# Altium project Motorsteuerung.PrjPcb
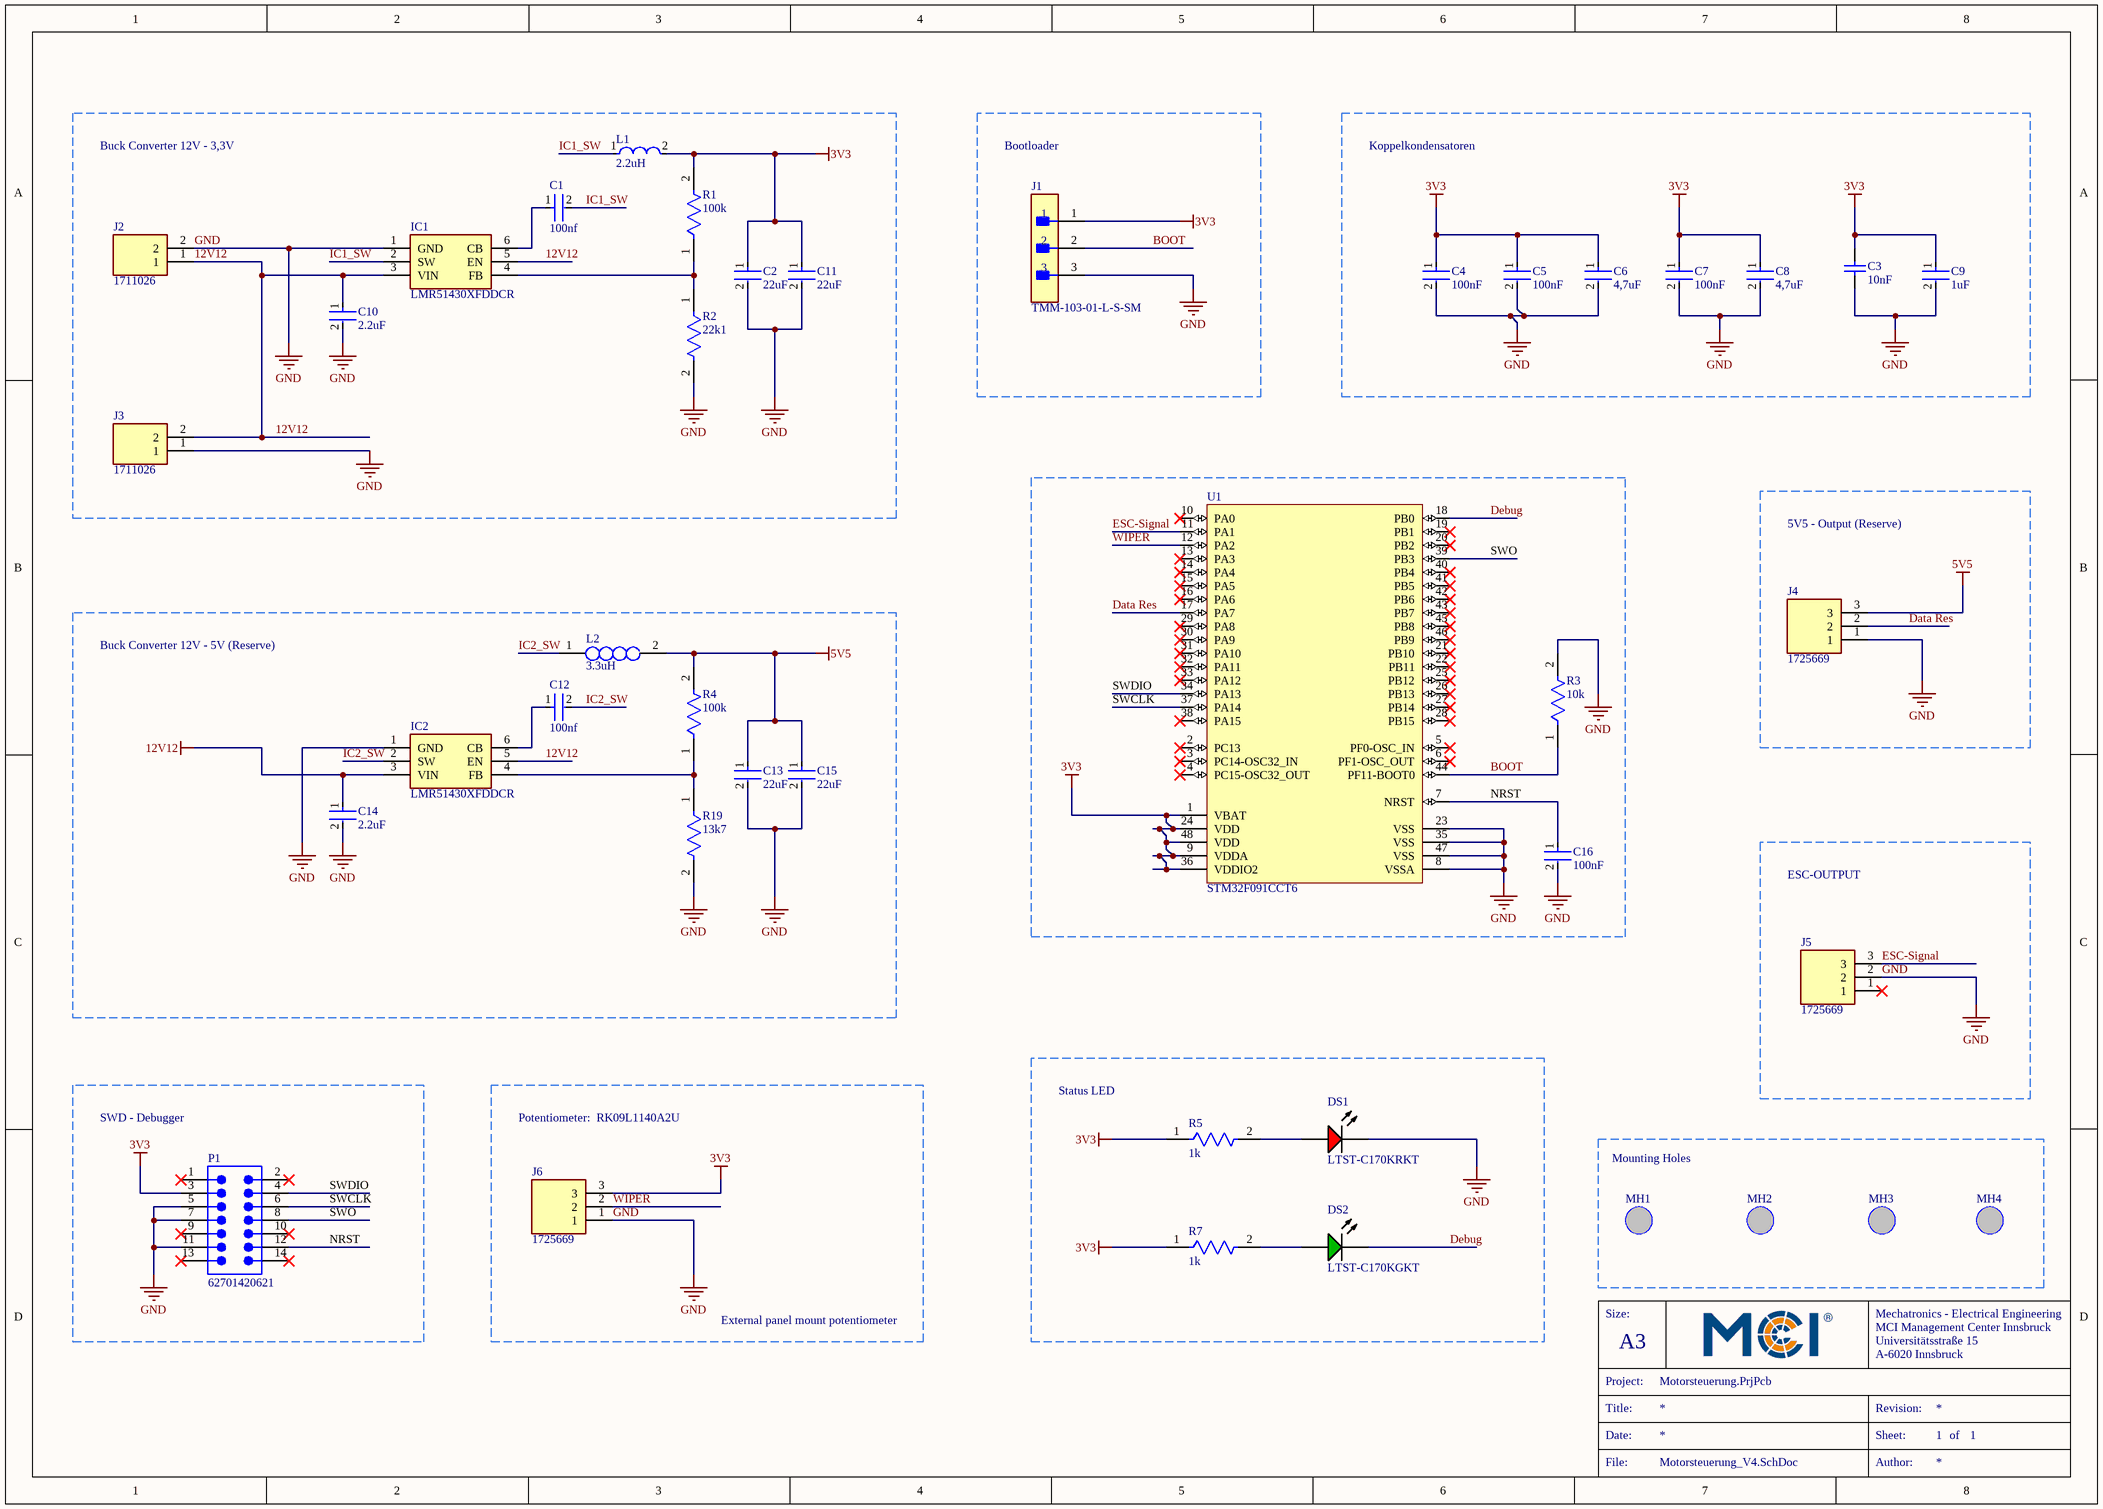
[diagram p0: Motorsteuerung_V4.SchDoc]
1 sheet, 41 parts. Net scope: global (net labels, ports and power ports of the same name join across sheets).
Board file: PCB1.PcbDoc

## Sheet Motorsteuerung_V4.SchDoc
size A3; CompanyName: MCI Management Center Innsbruck; Address1: Universitätsstraße 15; Address2: A-6020 Innsbruck; SheetNumber: 1; SheetTotal: 1

### Parts
C1  100nf  [FP-C0805C104M5UACTU-MFG]
C2  22uF  [FP-C1210C226K4RACTU-MFG]
C3  10nF  [CAPC1608X92X38ML15T08]
C4  100nF  [FP-CC0603-DA-MFG]
C5  100nF  [FP-CC0603-DA-MFG]
C6  4,7uF  [FP-CC0603-DA-MFG]
C7  100nF  [FP-CC0603-DA-MFG]
C8  4,7uF  [FP-CC0603-DA-MFG]
C9  1uF  [FP-CC0603-DA-MFG]
C10  2.2uF  [FP-CC1210-G3-MFG]
C11  22uF  [FP-C1210C226K4RACTU-MFG]
C12  100nf  [FP-C0805C104M5UACTU-MFG]
C13  22uF  [FP-C1210C226K4RACTU-MFG]
C14  2.2uF  [FP-CC1210-G3-MFG]
C15  22uF  [FP-C1210C226K4RACTU-MFG]
C16  100nF  [FP-CC0805-EB-MFG]
DS1  LTST-C170KRKT  [LTST-C170KRKT_V]
DS2  LTST-C170KGKT  [LTST-LTST-C170KGKT-2_V]
IC1  LMR51430XFDDCR  [SOT95P280X110-6N]
IC2  LMR51430XFDDCR  [SOT95P280X110-6N]
J1  TMM-103-01-L-S-SM  [FP-TMM-103-01-L-S-SM-MFG]
J2  1711026  [1711026]
J3  1711026  [1711026]
J4  1725669  [1725669]
J5  1725669  [1725669]
J6  1725669  [1725669]
L1  2.2uH  [FP-IHLP-2020BZ-FP_1_905x2-MFG]
L2  3.3uH  [INDPM6054X300N]
MH1  (no value)  [MTH]
MH2  (no value)  [MTH]
MH3  (no value)  [MTH]
MH4  (no value)  [MTH]
P1  62701420621  [62701420621]
R1  100k  [FP-RQ73C2A-IPC_B]
R2  22k1  [FP-RT0805-MFG]
R3  10k  [FP-AT0805-MFG]
R4  100k  [FP-RQ73C2A-IPC_B]
R5  1k  [FP-AT0805-IPC_C]
R7  1k  [FP-AT0805-IPC_C]
R19  13k7  [FP-RT0805-MFG]
U1  STM32F091CCT6  [LQFP48_M]

### Blocks framed on the sheet
Buck Converter 12V - 3,3V: C1 C2 C10 C11 IC1 J2 J3 L1 R1 R2
Bootloader: J1
Koppelkondensatoren: C3-C9
5V5 - Output (Reserve): J4
Buck Converter 12V - 5V (Reserve): C12-C15 IC2 L2 R4 R19
ESC-OUTPUT: J5
SWD - Debugger: P1
Status LED: DS1 DS2 R5 R7
Mounting Holes: MH1-MH4

### Nets
3V3: C2.1 C3.2 C4.1 C5.1 C6.1 C7.1 C8.1 C9.1 C11.1 J1.1 J6.3 L1.2 P1.3 R1.2 R5.1 R7.1 U1.1(VBAT) U1.9(VDDA) U1.24(VDD) U1.36(VDDIO2) U1.48(VDD)
5V5: C13.1 C15.1 J4.3 L2.2 R4.2
12V12: C10.1 C14.1 IC1.3(VIN) IC1.5(EN) IC2.3(VIN) IC2.5(EN) J2.1 J3.2
GND: C2.2 C3.1 C4.2 C5.2 C6.2 C7.2 C8.2 C9.2 C10.2 C11.2 C13.2 C14.2 C15.2 C16.2 DS1.2(K) IC1.1(GND) IC2.1(GND) J1.3 J2.2 J3.1 J4.1 J5.2 J6.1 P1.5 P1.7 P1.11 R2.2 R3.2 R19.2 U1.8(VSSA) U1.23(VSS) U1.35(VSS) U1.47(VSS)
BOOT: J1.2 R3.1 U1.44(PF11-BOOT0)
Data Res: J4.2 U1.17(PA7)
Debug: DS2.1(K) U1.18(PB0)
ESC-Signal: J5.3 U1.11(PA1)
IC1_SW: C1.2 IC1.2(SW) L1.1
IC2_SW: C12.2 IC2.2(SW) L2.1
NRST: C16.1 P1.12 U1.7(NRST)
SWCLK: P1.6 U1.37(PA14)
SWDIO: P1.4 U1.34(PA13)
SWO: P1.8 U1.39(PB3)
WIPER: J6.2 U1.12(PA2)
NetC1_1: C1.1 IC1.6(CB)
NetC12_1: C12.1 IC2.6(CB)
NetDS1_1: DS1.1(A) R5.2
NetDS2_2: DS2.2(A) R7.2
NetIC1_4: IC1.4(FB) R1.1 R2.1
NetIC2_4: IC2.4(FB) R4.1 R19.1

Not connected (* = marked no-connect by the designer): J5 1*; P1 1* 2* 9* 10* 13* 14*; U1 2(PC13)* 3(PC14-OSC32_IN)* 4(PC15-OSC32_OUT)* 5(PF0-OSC_IN)* 6(PF1-OSC_OUT)* 10(PA0)* 13(PA3)* 14(PA4)* 15(PA5)* 16(PA6)* 19(PB1)* 20(PB2)* 21(PB10)* 22(PB11)* 25(PB12)* 26(PB13)* 27(PB14)* 28(PB15)* 29(PA8)* 30(PA9)* 31(PA10)* 32(PA11)* 33(PA12)* 38(PA15)* 40(PB4)* 41(PB5)* 42(PB6)* 43(PB7)* 45(PB8)* 46(PB9)*

### Notes on the sheet
- Potentiometer:  RK09L1140A2U
- External panel mount potentiometer
- Size:
- Mechatronics - Electrical Engineering
- Project:
- A3
- Title:
- Date:
- Revision:
- Sheet:
- of
- File:
- Author:

### Library data of the parts
C1 C12 = CMP-2007-03742-2: CAP CER 0.1UF 50V Z5U 0805; Dielectric Material: Ceramic; Tolerance: 20%; Dissipation Factor: 4%; Height: 0.78mm; Dielectric: Z5U; REACH SVHC: No SVHC; Min Operating Temperature: 10°C; Lead Pitch: 0.75mm; Construction: Flat; Mount: Surface Mount; Max Operating Temperature: 85°C; RoHS Compliant: Yes; Width: 1.2mm; Contact Plating: Tin; Thickness: 0.035inch; Series: C; Capacitance: 100nF; Packaging: Tape and Reel; Package Quantity: 1; Voltage Rating (DC): 50V; Termination: SMD/SMT; Voltage: 50V; Case Code (Metric): 2012; Depth: 1.25mm; Radiation Hardening: No; Case/Package: 0805; Length: 2mm; Case Code (Imperial): 0805; Voltage Rating: 50V; Number of Pins: 2; Lead Free: Lead Free
C2 C11 C13 C15 = CMP-03020-034651-1: CAP CER 22UF 16V X7R 1210; Dielectric Material: Ceramic; Tolerance: 10%; Dissipation Factor: 5%; Case Code (Imperial): 1210; Capacitance: 22uF; Height: 2.5mm; Termination: SMD/SMT; Package Quantity: 1000; Voltage Rating (DC): 16V; Voltage: 16V; Depth: 2.5mm; Case Code (Metric): 3225; Mount: Surface Mount; Packaging: Cut Tape; Dielectric: X7R; Length: 3.2mm; REACH SVHC: No SVHC; Case/Package: 1210; Min Operating Temperature: -55°C; Voltage Rating: 16V; Max Operating Temperature: 125°C; Weight: 0.000564oz; Width: 0.098inch; Thickness: 0.11inch
C3 = CMP-2006-01137-1: Manufacturer: Vitramon; Part Number: VJ0603Y103KXJAC
C4 C5 C7 = CMP-03422-000234-1: CAP CER 0.1UF 25V X7R 0603; Manufacturer: YAGEO; Manufacturer Part Number: CC0603KRX7R8BB104; Tolerance: 0.1; Temperature Coefficient: 15%; Material: Ceramic; Category: Cap; Capacitance: 100 nF; ComponentLink2URL: http://www.yageo.com/documents/recent/UPY-GPHC_X7R_6.3V-to-50V_18.pdf; Voltage Rating: 25 V; ComponentLink2Description: Datasheet; RoHS: TRUE; Octopart: https://octopart.com/cc0603krx7r8bb104-yageo-8376534; Mouser Description: CC Series 0603 0.1 uF 25 V ±10% Tolerance X7R SMT Multilayer Ceramic Capacitor; Device Class L2: Capacitors; Automotive: No; Temperature Range Low: -55°C; Lead Free: Yes; Temperature Range High: +125°C; Package: CC0603-DA; Temperature: -55°C to +125°C; Footprint Url: http://www.yageo.com/exep/pages/download/literatures/UPY-C_GEN_24.pdf; Height: 0.9mm; Voltage: 25 V; Temperature Characteristic: X7R; Value: 100 nF; Device Class L3: Ceramic Capacitors; Digikey Description: CAP CER 0.1UF 25V X7R 0603; Device Class L1: Passive Components
C6 C8 = CMP-03422-001236-1: CAP CER 4.7UF 16V X5R 0603; Manufacturer: YAGEO; Manufacturer Part Number: CC0603KRX5R7BB475; Temperature Coefficient: 15%; Material: Ceramic; Tolerance: 0.1; Temperature Characteristic: X5R; Footprint Url: http://www.yageo.com/exep/pages/download/literatures/UPY-C_GEN_24.pdf; ComponentLink2URL: http://www.yageo.com/documents/recent/UPY-GPHC_X7R_6.3V-to-50V_18.pdf; ComponentLink2Description: Datasheet; Device Class L3: Ceramic Capacitors; Category: Cap; Voltage Rating: 16 V; Automotive: No; Temperature Range High: +125°C; Value: 4.7 uF; Device Class L1: Passive Components; RoHS: TRUE; Device Class L2: Capacitors; Voltage: 16 V; Height: 0.9mm; Temperature Range Low: -55°C; Temperature: -55°C to +125°C; Capacitance: 4.7 uF; Mouser Description: Multilayer Ceramic Capacitors MLCC - SMD/SMT 4.7uF 16V X5R 10%; Octopart: https://octopart.com/cc0603krx5r7bb475-yageo-34978295; Package: CC0603-DA; Lead Free: Yes; Digikey Description: CAP CER 4.7UF 16V X5R 0603
C9 = CMP-1035-02737-2: CAP CER 1UF 16V X5R 0603; Manufacturer Part Number: CC0603KRX5R7BB105; Manufacturer: YAGEO; Material: Ceramic; Temperature Coefficient: 15%; Tolerance: 0.1; Digikey Description: CAP CER 1UF 16V X5R 0603; Category: Cap; Automotive: No; Octopart: https://octopart.com/cc0603krx5r7bb105-yageo-8376530; Voltage Rating: 16 V; Device Class L3: Ceramic Capacitors; Value: 1 uF; Temperature Characteristic: X5R; Voltage: 16 V; RoHS: TRUE; Lead Free: Yes; Temperature: -55°C to +125°C; Device Class L2: Capacitors; ComponentLink2URL: http://www.yageo.com/documents/recent/UPY-GPHC_X7R_6.3V-to-50V_18.pdf; Capacitance: 1 uF; Footprint Url: http://www.yageo.com/exep/pages/download/literatures/UPY-C_GEN_24.pdf; Height: 0.9mm; ComponentLink2Description: Datasheet; Temperature Range High: +125°C; Mouser Description: Multilayer Ceramic Capacitors MLCC - SMD/SMT 1.0uF 16V X5R 10%; Package: CC0603-DA; Device Class L1: Passive Components; Temperature Range Low: -55°C
C10 C14 = CMP-03422-001503-1: CAP CER 1210; Dielectric: X7R; Tolerance: 10%; Depth: 2.5mm; Max Operating Temperature: 125°C; Capacitance: 2.2uF; RoHS Compliant: Yes; Length: 3.2mm; Min Operating Temperature: -55°C; Case/Package: 1210; Packaging: Tape and Reel
C16 = CMP-00621-107850848-1: CC0805KKX7RYBB104 Capacitor Ceramic 0.01uF 250V X7R 10% 0805 T/R; Material: Ceramic; Max Operating Temperature: 125°C; Tolerance: 10%; Case/Package: 0805; NexarPartId: 107850848; Height: 1.45mm; Capacitance: 100nF; Min Operating Temperature: -55°C; Voltage Rating: 250V
DS1 = CMP-2000-07593-1: LED Red, 75 mW, 54 mcd, -55 to 85 degC, 2-Pin SMD, RoHS, Tape and Reel; Manufacturer: Lite-On; Lens Transparency: Clear; Number of Elements: 1; Power Rating: 75mW; Luminous Intensity: 54mcd; Viewing Angle: 130degrees; Forward Current: 30mA; Wavelength: 639nm; Lens Style: Rectangular; Case\/Package: 0805; Test Current: 20mA; Dominant Wavelength: 631nm; Forward Voltage: 2V; Lens Colour: Colorless; Min Operating Temperature: -55degC; RoHSCompliant: True; Length: 3.2mm; Width: 1.25mm; Mount: SurfaceMount; Packaging: TapeandReel; Number of LEDs: 1; Radiation Hardening: No; Datasheet URL: http://optoelectronics.liteon.com/upload/download/DS-22-99-0150/LTST-C170KRKT.pdf; Datasheet Version: Rev. D, 11/2014; Case Code (Metric): 2012; Height: 1.1mm; Number of Pins: 2; Package Description: 2-Pin Surface Mount Device, Body 2 x 1.25 mm; Manufacturer URL: http://www.us.liteon.com/; Lead Free: LeadFree; Illumination Colour: Red; Colour: Red; Case Code (Imperial): 0805; Max Operating Temperature: 85degC; Power Dissipation: 75mW; Mounting Technology: SurfaceMount; Package Reference: C170KRKT; Package Quantity: 1; Depth: 1.6mm
DS2 = CMP-2000-06620-1: Ultra Bright AlInGaP Chip LED, 75 mW, -55 to 85 degC, 2-Pin SMD (0805), RoHS, Tape and Reel; Manufacturer: Lite-On; Forward Current: 30mA; Power Dissipation Max: 75mW; Emitting Color: YellowGreen; Type: Uni-Color; Forward Voltage: 2.4V; Dominant Wave Length: 571nm; Test Current (It): 20mA; Product Length (mm): 2mm; Peak Wavelength: 574nm; Power Dissipation: 75W; Product Depth (mm): 1.25mm; DELETED: Compliant; High Brightness: Yes; Product Height (mm): 1.1mm; Luminous Intensity: 35mcd; Shape Type: Rectangular; Chip Material: AlGaInP; Viewing Angle: 130deg; Number of  Elements: 1; Reverse Voltage: 5V; Rad Hardened: No; Package Type: ChipLed; Manufacturer URL: http://www.us.liteon.com/; Mounting: SurfaceMount; Operating Temp Range: -55Cto85C; Datasheet URL: http://optoelectronics.liteon.com/upload/download/DS22-2000-073/S_110_LTST-C170KGKT.pdf; Packaging: TapeandReel; Pin Count: 2; Package Description: 2-Pin Surface Mounted Device, Body 2 x 1.25 mm; Mounting Technology: SurfaceMount; Package Reference: LTST-C170KGKT-2; Forward Current Max: 30mA; Datasheet Version: Rev. G, 06/2005; Lens Dimensions: 1.4x1.25x0.6mm; Operating Temperature Classification: Industrial; Lum Intensity: 35mcd; Main Category: ChipLED
IC1 IC2 = LMR51430XFDDCR: Integrated Circuit; Manufacturer_Name: Texas Instruments; Datasheet Link: https://www.ti.com/lit/ds/symlink/lmr51420.pdf?ts=1651317966125; Height: 1.1mm; Manufacturer_Part_Number: LMR51430XFDDCR; Mouser Part Number: 595-LMR51430XFDDCR; Mouser Price/Stock: https://www.mouser.co.uk/ProductDetail/Texas-Instruments/LMR51430XFDDCR?qs=vvQtp7zwQdOoH7ISqkGKmw%3D%3D; Arrow Part Number: LMR51430XFDDCR; Arrow Price/Stock: https://www.arrow.com/en/products/lmr51430xfddcr/texas-instruments.html?utm_currency=USD&region=nac
J1 = CMP-02766-001735-1: CONN HEADER SMD 3POS 2MM; Number of Positions: 3; Max Current Rating: 3.9A; Gender: Male; Max Voltage Rating (AC): 500V; Packaging: Bulk; Housing Color: Black; Connector Type: Header; Min Operating Temperature: -55°C; Contact Plating: Gold; Radiation Hardening: No; Insulation Color: Black; Housing Material: Polymer; Contact Shape: Square; Max Operating Temperature: 125°C; Fastening Type: Pull; Termination: Solder; Depth: 1.97mm; Series: TMM; Number of Contacts: 3; Contact Material: Bronze; RoHS Compliant: Yes; REACH SVHC: No SVHC; Contact Type: Male Pin; Pitch: 2mm; Insulation Material: Polymer; Lead Free: Lead Free; Orientation: Straight; Flammability Rating: UL94 V-0; Length: 6mm; Number of Rows: 1; Contact Finish - Mating: GOLD
J2 J3 = 1711026: Connector; Manufacturer_Name: Phoenix Contact; Datasheet Link: https://www.phoenixcontact.com/en-us/products/printed-circuit-board-terminal-mkds-3-2-1711026?type=pdf; Height: 18.2mm; Manufacturer_Part_Number: 1711026; Mouser Part Number: 651-1711026; Mouser Price/Stock: https://www.mouser.co.uk/ProductDetail/Phoenix-Contact/1711026?qs=JcjeNNoqGSMahJ%2FDM5awSg%3D%3D; Arrow Part Number: 1711026; Arrow Price/Stock: https://www.arrow.com/en/products/1711026/phoenix-contact?utm_currency=USD&region=nac
J4-J6 = 1725669: Connector; Manufacturer_Name: Phoenix Contact; Datasheet Link: https://www.phoenixcontact.com/en-us/products/printed-circuit-board-terminal-mpt-05-3-254-1725669?type=pdf; Height: 8.65mm; Manufacturer_Part_Number: 1725669; Mouser Part Number: 651-1725669; Mouser Price/Stock: https://www.mouser.co.uk/ProductDetail/Phoenix-Contact/1725669?qs=A%2FKWGUWTCZjmkTL0Oe91ew%3D%3D; Arrow Part Number: 1725669; Arrow Price/Stock: https://www.arrow.com/en/products/1725669/phoenix-contact?utm_currency=USD&region=nac
L1 = CMP-02424-000260-1: Fixed Inductors Commercial Low DCR Series 2.2uH 5A 37.7mΩ 20%; Test Frequency: 100kHz; Self Resonant Frequency: 41MHz; Shielding: Shielded; Saturation Current: 5.5A; DC Resistance (DCR): 37.7mR; Core Material: Metal; RMS Current (Irms): 5A; Case/Package: 2020; Width: 0.204inch; Inductance: 2.2uH; Height - Seated (Max): 0.079inch; Package Quantity: 2000; Length: 5.74mm; Inductance Tolerance: 20%; Tolerance: 20%; Height: 2mm; Min Operating Temperature: -55°C; Termination: SMD/SMT; Current Rating: 5A; Mount: Surface Mount; Max DC Current: 5.5A; Packaging: Tape and Reel; Number of Pins: 2; Max Operating Temperature: 125°C; Depth: 5.43mm; Military Standard: Not; Radiation Hardening: No; Contact Plating: Tin; Lead Free: Lead Free
L2 = PA4340.332NLT: Inductor; Manufacturer_Name: Yageo Group; Datasheet Link: https://www.arrow.com/en/products/pa4340.332nlt/pulse-electronics-corporation; Height: 3mm; Manufacturer_Part_Number: PA4340.332NLT; Mouser Part Number: 673-PA4340.332NLT; Mouser Price/Stock: https://www.mouser.co.uk/ProductDetail/Pulse-Electronics/PA4340332NLT?qs=%2FzQKu7YvIMZ40DmrCvsoMQ%3D%3D; Arrow Part Number: PA4340.332NLT; Arrow Price/Stock: https://www.arrow.com/en/products/pa4340.332nlt/pulse-electronics-corporation?utm_currency=USD&region=europe
MH1-MH4 = MountingHole
P1 = CMP-03913-133967346-2: Conn, Hdr, 14Pos, 2Row, 1.27Mm, Smt Rohs Compliant: Yes; Current Rating: 1A; Insulation Resistance: 1GΩ; Max Operating Temperature: 105°C; Min Operating Temperature: -40°C; Number of Pins: 14; RoHS: Compliant; Pitch: 1.27mm; Length: 13.64mm
R1 R4 = CMP-03211-011351-1: RQ73 0805 100KΩ 0.2W 10ppm/°C 0.1% 100V
R2 = CMP-2001-01692-2: RES SMD 22.1K OHM 0.1% 1/8W 0805; Manufacturer Part Number: RT0805BRD0722K1L; Manufacturer: Yageo; Temperature Coefficient: 25 ppm/°C; Voltage Rating: 150V; Tolerance: 0.0025; Resistance: 22.1KΩ; Value: 22.1KΩ; Power Rating: 0.125W; Lead Free: Yes; Series: RT; Digikey Description: RES SMD 22.1K OHM 0.1% 1/8W 0805; Mouser Description: Thin Film Resistors - SMD 1/8W 22.1K ohm .1% 25ppm; Device Class L3: Chip SMD Resistors; ComponentLink2URL: http://www.yageo.com/documents/recent/PYu-RT_1-to-0.01_RoHS_L_9.pdf; Octopart: https://octopart.com/rt0805brd0722k1l-yageo-1447960; ComponentLink2Description: Datasheet; Temperature Range High: +155°C; Height: 0.6mm; Composition: Thin Film; Temperature Range Low: -55°C; RoHS: TRUE; Device Class L2: Resistors; Automotive: No; Ipc Land Pattern Name: RESC200125X50; Device Class L1: Passive Components; Temperature: -55°C to +155°C; Category: Res; Package: RT0805; Footprint Url: http://www.yageo.com/exep/pages/download/literatures/PYu-R_Mount_10.pdf
R3 = CMP-03412-049031-1: Thin Film Chip Resistors Automotive Grade 10kΩ 0.5% 50ppm/°C 0805; Max Power Dissipation: 125mW; Resistance: 10kR; Ratings: AEC-Q200; Length: 0.079inch; Temperature Coefficient: 50ppm/°C; Height: 0.024inch; Min Operating Temperature: -55°C; Case/Package: 0805; Tolerance: 0.5%; RoHS Compliant: Yes; Features: Moisture Resistant; Number of Terminations: 2; Max Operating Temperature: 155°C; Series: AT; Packaging: Tape and Reel; Width: 0.049inch; Resistor Type: Thin Film
R5 R7 = CMP-03412-050024-1: Thin Film Chip Resistors Automotive Grade 1kΩ 0.1% 50ppm/°C 0805
R19 = CMP-03412-025952-1: RES 13.7K OHM 1/8W .1% SMD 0805; Manufacturer Part Number: RT0805BRD0713K7L; Manufacturer: Yageo; Power Rating: 0.125W; Tolerance: 0.0025; Value: 13.7KΩ; Voltage Rating: 150V; Temperature Coefficient: 25 ppm/°C; Device Class L3: Chip SMD Resistors; Temperature Range High: +155°C; Digikey Description: RES 13.7K OHM 1/8W .1% SMD 0805; ComponentLink2Description: Datasheet; Package: RT0805; RoHS: TRUE; ComponentLink2URL: http://www.yageo.com/documents/recent/PYu-RT_1-to-0.01_RoHS_L_9.pdf; Automotive: No; Lead Free: Yes; Device Class L1: Passive Components; Temperature: -55°C to +155°C; Category: Res; Ipc Land Pattern Name: RESC200125X50; Octopart: https://octopart.com/rt0805brd0713k7l-yageo-1409410; Height: 0.6mm; Resistance: 13.7KΩ; Footprint Url: http://www.yageo.com/exep/pages/download/literatures/PYu-R_Mount_10.pdf; Series: RT; Temperature Range Low: -55°C; Composition: Thin Film; Mouser Description: Thin Film Resistors - SMD 1/8W 13.7K ohm .1% 25ppm; Device Class L2: Resistors
U1 = CMP-0304-00055-1: ARM-based 32-bit MCU, CAN, 12 timers, ADC, DAC & Comm. Interface, 2 to 3.6 V, -40 to 85 degC, 48-Pin LQFP, RoHS, Tray; Manufacturer: STMicroelectronics; CPU Frequency: 48 MHz Max.; GPIOs: 37; SRAM: 32 Kbytes; Capacitive Sensing Channels: 16; Flash: 256 Kbytes; ComponentLink2URL: http://www.st.com/st-web-ui/static/active/en/resource/technical/document/datasheet/DM00115237.pdf; RoHS: TRUE; ComponentLink1Description: Manufacturer URL; ComponentLink3URL: http://www.st.com/st-web-ui/static/active/en/resource/technical/document/datasheet/DM00115237.pdf; Operating Voltage: 2 to 3.6 V; ComponentLink1URL: www.st.com; DatasheetVersion: Rev. 2; Mounting Technology: Surface Mount; ComponentLink2Description: Datasheet; ComponentLink3Description: Package Specification; Packing: Tray; PackageDescription: 48-Pin Low-Profile Quad Flat Package, Body 7 x 7 mm, Pitch 0.5 mm; Temperature Range: -40 to 85 degC; PartNumber: STM32F091CCT6